# Altium project LXe_digitizer.PrjPcb (part 1 of 3)
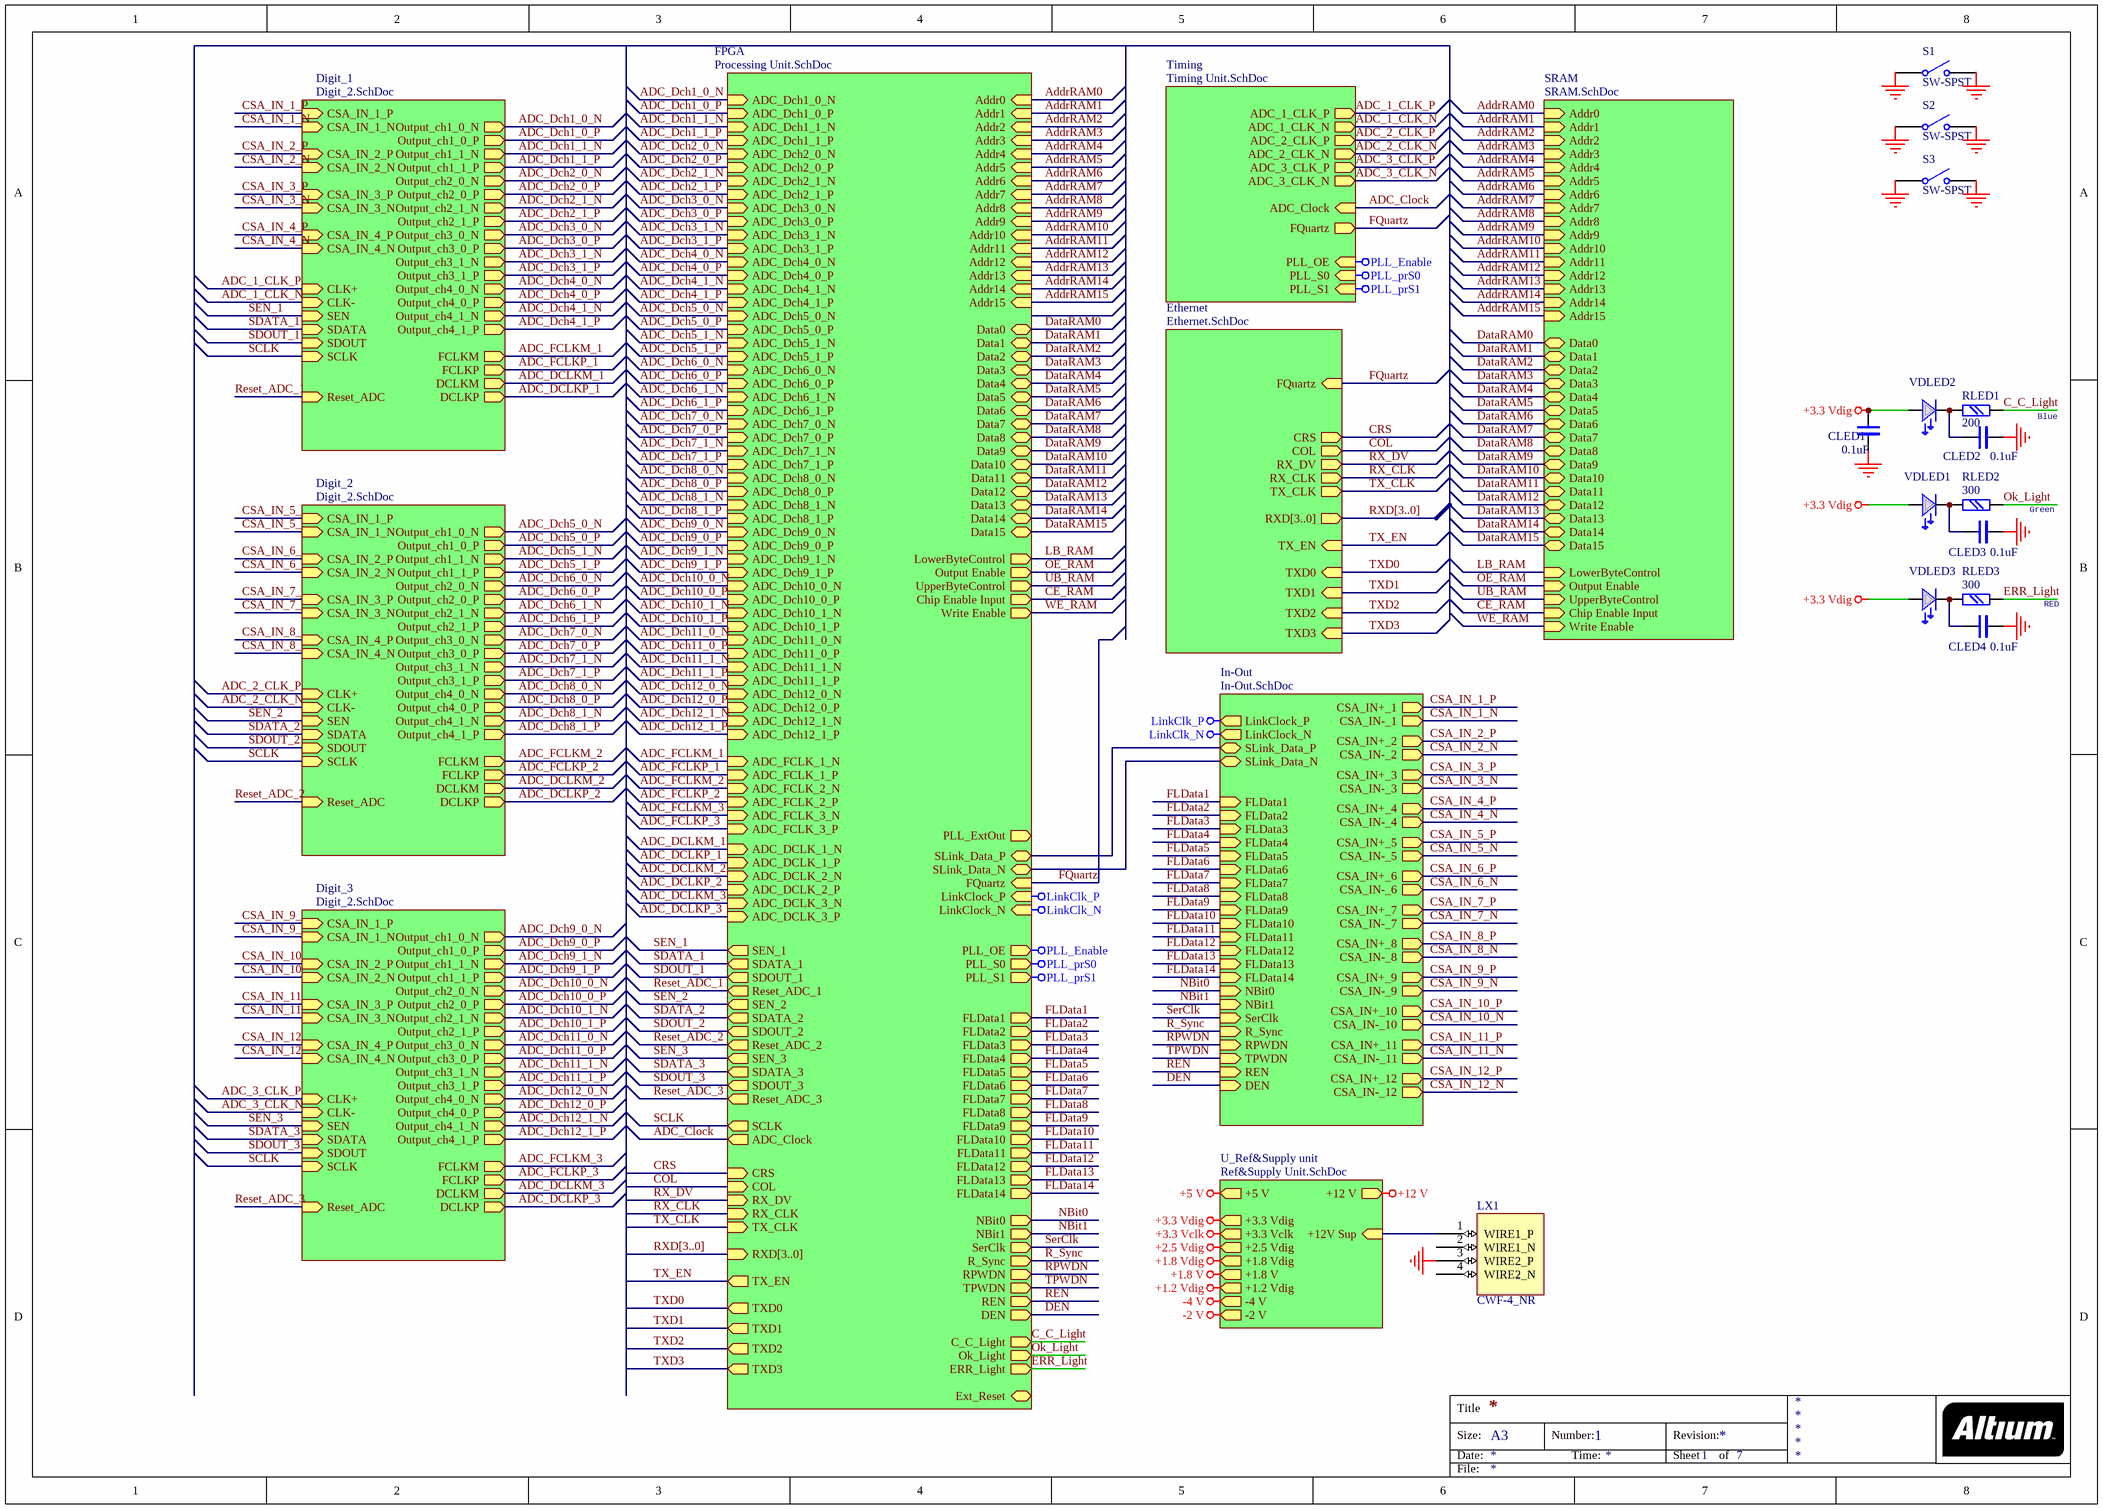
[diagram p0: Main schem.SchDoc]
9 sheets, 784 parts. Net scope: hierarchical (ports join the sheet entries above them; power ports are global).
Board file: New_LXe_twr.PcbDoc
Sheets:
  Main schem.SchDoc
    Digit_1 = Digit_2.SchDoc
      Analog_input = Analog.SchDoc
      Analog_input = Analog.SchDoc
      Analog_input = Analog.SchDoc
      Analog_input = Analog.SchDoc
    U_Ref&Supply unit = Ref&Supply Unit.SchDoc
    FPGA = Processing Unit.SchDoc
    Timing = Timing Unit.SchDoc
    In-Out = In-Out.SchDoc
    Ethernet = Ethernet.SchDoc
    Digit_2 = Digit_2.SchDoc
      Analog_input = Analog.SchDoc
      Analog_input = Analog.SchDoc
      Analog_input = Analog.SchDoc
      Analog_input = Analog.SchDoc
    Digit_3 = Digit_2.SchDoc
      Analog_input = Analog.SchDoc
      Analog_input = Analog.SchDoc
      Analog_input = Analog.SchDoc
      Analog_input = Analog.SchDoc
    SRAM = SRAM.SchDoc

## Sheet Main schem.SchDoc
size A3; DocumentNumber: 1; SheetNumber: 1; SheetTotal: 7

### Parts
CLED1  0.1uF  [chip0805]
CLED2  0.1uF  [chip0603]
CLED3  0.1uF  [chip0603]
CLED4  0.1uF  [chip0603]
LX1  CWF-4_NR  [CWF-4R]
RLED1  200  [chip0603]
RLED2  300  [chip0603]
RLED3  300  [chip0603]
S1  SW-SPST  [SPST-2]
S2  SW-SPST  [SPST-2]
S3  SW-SPST  [SPST-2]
VDLED1  LED  [LED0805]  (value not drawn)
VDLED2  LED  [LED1206]  (value not drawn)
VDLED3  LED  [LED1206]  (value not drawn)

### Sub-sheets
Digit_1 = Digit_2.SchDoc: Output_ch1_0_P (out), Output_ch1_0_N (out), Output_ch1_1_P (out), Output_ch1_1_N (out), CLK+ (in), Output_ch2_0_N (out), Output_ch2_0_P (out), Output_ch2_1_N (out), Output_ch2_1_P (out), Output_ch3_0_N (out), Output_ch3_0_P (out), Output_ch3_1_N (out), Output_ch3_1_P (out), Output_ch4_0_N (out), Output_ch4_0_P (out), Output_ch4_1_N (out), Output_ch4_1_P (out), CLK- (in), CSA_IN_1_P (in), CSA_IN_1_N (in), CSA_IN_2_P (in), CSA_IN_2_N (in), CSA_IN_3_P (in), CSA_IN_3_N (in), CSA_IN_4_P (in), CSA_IN_4_N (in), SEN (in), SDATA (in), SCLK (in), SDOUT (in), Reset_ADC (in), FCLKM (out), FCLKP (out), DCLKM (out), DCLKP (out)
Digit_2 = Digit_2.SchDoc: Output_ch1_0_P (out), Output_ch1_0_N (out), Output_ch1_1_P (out), Output_ch1_1_N (out), CLK+ (in), Output_ch2_0_N (out), Output_ch2_0_P (out), Output_ch2_1_N (out), Output_ch2_1_P (out), Output_ch3_0_N (out), Output_ch3_0_P (out), Output_ch3_1_N (out), Output_ch3_1_P (out), Output_ch4_0_N (out), Output_ch4_0_P (out), Output_ch4_1_N (out), Output_ch4_1_P (out), CLK- (in), CSA_IN_1_P (in), CSA_IN_1_N (in), CSA_IN_2_P (in), CSA_IN_2_N (in), CSA_IN_3_P (in), CSA_IN_3_N (in), CSA_IN_4_P (in), CSA_IN_4_N (in), SEN (in), SDATA (in), SCLK (in), SDOUT (in), Reset_ADC (in), FCLKM (out), FCLKP (out), DCLKM (out), DCLKP (out)
Digit_3 = Digit_2.SchDoc: Output_ch1_0_P (out), Output_ch1_0_N (out), Output_ch1_1_P (out), Output_ch1_1_N (out), CLK+ (in), Output_ch2_0_N (out), Output_ch2_0_P (out), Output_ch2_1_N (out), Output_ch2_1_P (out), Output_ch3_0_N (out), Output_ch3_0_P (out), Output_ch3_1_N (out), Output_ch3_1_P (out), Output_ch4_0_N (out), Output_ch4_0_P (out), Output_ch4_1_N (out), Output_ch4_1_P (out), CLK- (in), CSA_IN_1_P (in), CSA_IN_1_N (in), CSA_IN_2_P (in), CSA_IN_2_N (in), CSA_IN_3_P (in), CSA_IN_3_N (in), CSA_IN_4_P (in), CSA_IN_4_N (in), SEN (in), SDATA (in), SCLK (in), SDOUT (in), Reset_ADC (in), FCLKM (out), FCLKP (out), DCLKM (out), DCLKP (out)
Ethernet = Ethernet.SchDoc: COL (out), TX_EN (in), TX_CLK (out), RX_CLK (out), RX_DV (out), TXD0 (in), RXD[3..0] (out), CRS (out), FQuartz (in), TXD1 (in), TXD2 (in), TXD3 (in)
FPGA = Processing Unit.SchDoc: ADC_Dch1_0_P (in), ADC_Dch1_0_N (in), ERR_Light (out), Ok_Light (out), C_C_Light (out), LinkClock_P (in), SLink_Data_P (bidir), SLink_Data_N (bidir), PLL_ExtOut (out), FQuartz (in), Ext_Reset, PLL_OE (out), PLL_S0 (out), PLL_S1 (out), FLData1 (out), FLData2 (out), FLData3 (out), FLData4 (out), FLData5 (out), FLData6 (out), FLData7 (out), FLData8 (out), NBit0 (out), NBit1 (out), SerClk (out), R_Sync (out), RPWDN (out), FLData9 (out), FLData10 (out), TPWDN (out), REN (out), DEN (out), SEN_1 (out), SDATA_1 (out), SCLK (out), SDOUT_1 (out), ADC_Dch1_1_P (in), ADC_Dch1_1_N (in), ADC_Dch2_0_P (in), ADC_Dch2_0_N (in), ADC_Dch2_1_P (in), ADC_Dch2_1_N (in), ADC_Dch3_0_P (in), ADC_Dch3_0_N (in), ADC_Dch3_1_P (in), ADC_Dch3_1_N (in), ADC_Dch4_0_P (in), ADC_Dch4_0_N (in), ADC_Dch4_1_P (in), ADC_Dch4_1_N (in), ADC_Dch5_0_P (in), ADC_Dch5_0_N (in), ADC_Dch5_1_P (in), ADC_Dch5_1_N (in), ADC_Dch6_0_P (in), ADC_Dch6_0_N (in), ADC_Dch6_1_P (in), ADC_Dch6_1_N (in), ADC_Dch7_0_P (in), ADC_Dch7_0_N (in), ADC_Dch7_1_P (in), ADC_Dch7_1_N (in), ADC_Dch8_0_P (in), ADC_Dch8_0_N (in), ADC_Dch8_1_P (in), ADC_Dch8_1_N (in), ADC_Dch9_0_P (in), ADC_Dch9_0_N (in), ADC_Dch9_1_P (in), ADC_Dch9_1_N (in), ADC_Dch10_0_P (in), ADC_Dch10_0_N (in), ADC_Dch10_1_P (in), ADC_Dch10_1_N (in), ADC_Dch11_0_P (in), ADC_Dch11_0_N (in), ADC_Dch11_1_P (in), ADC_Dch11_1_N (in), ADC_Dch12_0_P (in), ADC_Dch12_0_N (in), ADC_Dch12_1_P (in), ADC_Dch12_1_N (in), FLData11 (out), FLData12 (out), FLData13 (out), FLData14 (out), COL (in), TX_EN (out), TX_CLK (in), RX_CLK (in), RX_DV (in), RXD[3..0] (in), CRS (in), ADC_FCLK_1_P (in), ADC_FCLK_1_N (in), ADC_FCLK_2_P (in), ADC_FCLK_2_N (in), ADC_FCLK_3_P (in), ADC_FCLK_3_N (in), TXD0 (out), TXD1 (out), TXD2 (out), TXD3 (out), LinkClock_N (in), Addr0 (in), Addr1 (in), Addr2 (in), Addr3 (in), Addr4 (in), Addr5 (in), Addr6 (in), Addr7 (in), Addr8 (in), Addr9 (in), Addr10 (in), Addr11 (in), Addr12 (in), Addr13 (in), Addr14 (in), Addr15 (in), Data0 (bidir), Data1 (bidir), Data2 (bidir), Data3 (bidir), Data4 (bidir), Data5 (bidir), Data6 (bidir), Data7 (bidir), Data8 (bidir), Data9 (bidir), Data10 (bidir), Data11 (bidir), Data12 (bidir), Data13 (bidir), Data14 (bidir), Data15 (bidir), LowerByteControl (out), Output Enable (out), UpperByteControl (out), Chip Enable Input (out), Write Enable (out), SEN_2 (out), SDATA_2 (out), SDOUT_2 (out), SEN_3 (out), SDATA_3 (out), SDOUT_3 (out), ADC_DCLK_1_P (in), ADC_DCLK_1_N (in), ADC_DCLK_2_P (in), ADC_DCLK_2_N (in), ADC_DCLK_3_P (in), ADC_DCLK_3_N (in), ADC_Clock (out), Reset_ADC_1 (out), Reset_ADC_2 (out), Reset_ADC_3 (out)
In-Out = In-Out.SchDoc: SLink_Data_N (bidir), SLink_Data_P (bidir), LinkClock_P (out), FLData1 (in), FLData2 (in), FLData3 (in), FLData4 (in), FLData5 (in), FLData6 (in), FLData7 (in), FLData8 (in), NBit0 (in), NBit1 (in), SerClk (in), R_Sync (in), RPWDN (in), CSA_IN+_1 (out), CSA_IN-_1 (out), CSA_IN+_2 (out), CSA_IN-_2 (out), CSA_IN+_3 (out), CSA_IN-_3 (out), CSA_IN+_4 (out), CSA_IN-_4 (out), CSA_IN+_5 (out), CSA_IN-_5 (out), CSA_IN+_6 (out), CSA_IN-_6 (out), FLData9 (in), FLData10 (in), TPWDN (in), REN (in), DEN (in), CSA_IN+_7 (out), CSA_IN-_7 (out), CSA_IN+_8 (out), CSA_IN-_8 (out), CSA_IN+_9 (out), CSA_IN-_9 (out), CSA_IN+_10 (out), CSA_IN-_10 (out), CSA_IN+_11 (out), CSA_IN-_11 (out), CSA_IN+_12 (out), CSA_IN-_12 (out), FLData11 (in), FLData12 (in), FLData13 (in), FLData14 (in), LinkClock_N (out)
SRAM = SRAM.SchDoc: Addr0 (in), Addr1 (in), Addr2 (in), Addr3 (in), Addr4 (in), Addr5 (in), Addr6 (in), Addr7 (in), Addr8 (in), Addr9 (in), Addr10 (in), Addr11 (in), Addr12 (in), Addr13 (in), Addr14 (in), Addr15 (in), Data0 (bidir), Data1 (bidir), Data2 (bidir), Data3 (bidir), Data4 (bidir), Data5 (bidir), Data6 (bidir), Data7 (bidir), Data8 (bidir), Data9 (bidir), Data10 (bidir), Data11 (bidir), Data12 (bidir), Data13 (bidir), Data14 (bidir), Data15 (bidir), LowerByteControl (in), Output Enable (in), UpperByteControl (in), Chip Enable Input (in), Write Enable (in)
Timing = Timing Unit.SchDoc: FQuartz (out), PLL_OE (in), PLL_S0 (in), PLL_S1 (in), ADC_1_CLK_P (out), ADC_1_CLK_N (out), ADC_2_CLK_N (out), ADC_2_CLK_P (out), ADC_3_CLK_P (out), ADC_3_CLK_N (out), ADC_Clock (in)
U_Ref&Supply unit = Ref&Supply Unit.SchDoc: +12V Sup (in), +5 V (out), +3.3 Vdig (out), +3.3 Vclk (out), +2.5 Vdig (out), +1.8 Vdig (out), +1.8 V (out), +1.2 Vdig (out), -4 V (out), -2 V (out), +12 V (out)

### Nets
+3.3 Vdig: CLED1.1 VDLED1.ANOD VDLED2.ANOD VDLED3.ANOD ; sheet U_Ref&Supply unit/+3.3 Vdig
+12 V: LX1.1(WIRE1_P) ; sheet U_Ref&Supply unit/+12V Sup, sheet U_Ref&Supply unit/+12 V
GND: CLED1.2 CLED2.2 CLED3.2 CLED4.2 LX1.3(WIRE2_P) S1.1(COMMON) S1.2(NO) S2.1(COMMON) S2.2(NO) S3.1(COMMON) S3.2(NO)
LinkClk_N: sheet FPGA/LinkClock_N, sheet In-Out/LinkClock_N
LinkClk_P: sheet FPGA/LinkClock_P, sheet In-Out/LinkClock_P
PLL_Enable: sheet FPGA/PLL_OE, sheet Timing/PLL_OE  [project net PLL_OE]
PLL_prS0: sheet FPGA/PLL_S0, sheet Timing/PLL_S0  [project net PLL_S0]
PLL_prS1: sheet FPGA/PLL_S1, sheet Timing/PLL_S1  [project net PLL_S1]
ADC_1_CLK_N: sheet Digit_1/CLK-, sheet Timing/ADC_1_CLK_N
ADC_1_CLK_P: sheet Digit_1/CLK+, sheet Timing/ADC_1_CLK_P
ADC_2_CLK_N: sheet Timing/ADC_2_CLK_N, sheet Digit_2/CLK-
ADC_2_CLK_P: sheet Timing/ADC_2_CLK_P, sheet Digit_2/CLK+
ADC_3_CLK_N: sheet Timing/ADC_3_CLK_N, sheet Digit_3/CLK-
ADC_3_CLK_P: sheet Timing/ADC_3_CLK_P, sheet Digit_3/CLK+
ADC_Clock: sheet FPGA/ADC_Clock, sheet Timing/ADC_Clock
ADC_Dch1_0_N: sheet Digit_1/Output_ch1_0_N, sheet FPGA/ADC_Dch1_0_N
ADC_Dch1_0_P: sheet Digit_1/Output_ch1_0_P, sheet FPGA/ADC_Dch1_0_P
ADC_Dch1_1_N: sheet Digit_1/Output_ch1_1_N, sheet FPGA/ADC_Dch1_1_N
ADC_Dch1_1_P: sheet Digit_1/Output_ch1_1_P, sheet FPGA/ADC_Dch1_1_P
ADC_Dch2_0_N: sheet Digit_1/Output_ch2_0_N, sheet FPGA/ADC_Dch2_0_N
ADC_Dch2_0_P: sheet Digit_1/Output_ch2_0_P, sheet FPGA/ADC_Dch2_0_P
ADC_Dch2_1_N: sheet Digit_1/Output_ch2_1_N, sheet FPGA/ADC_Dch2_1_N
ADC_Dch2_1_P: sheet Digit_1/Output_ch2_1_P, sheet FPGA/ADC_Dch2_1_P
ADC_Dch3_0_N: sheet Digit_1/Output_ch3_0_N, sheet FPGA/ADC_Dch3_0_N
ADC_Dch3_0_P: sheet Digit_1/Output_ch3_0_P, sheet FPGA/ADC_Dch3_0_P
ADC_Dch3_1_N: sheet Digit_1/Output_ch3_1_N, sheet FPGA/ADC_Dch3_1_N
ADC_Dch3_1_P: sheet Digit_1/Output_ch3_1_P, sheet FPGA/ADC_Dch3_1_P
ADC_Dch4_0_N: sheet Digit_1/Output_ch4_0_N, sheet FPGA/ADC_Dch4_0_N
ADC_Dch4_0_P: sheet Digit_1/Output_ch4_0_P, sheet FPGA/ADC_Dch4_0_P
ADC_Dch4_1_N: sheet Digit_1/Output_ch4_1_N, sheet FPGA/ADC_Dch4_1_N
ADC_Dch4_1_P: sheet Digit_1/Output_ch4_1_P, sheet FPGA/ADC_Dch4_1_P
ADC_Dch5_0_N: sheet FPGA/ADC_Dch5_0_N, sheet Digit_2/Output_ch1_0_N
ADC_Dch5_0_P: sheet FPGA/ADC_Dch5_0_P, sheet Digit_2/Output_ch1_0_P
ADC_Dch5_1_N: sheet FPGA/ADC_Dch5_1_N, sheet Digit_2/Output_ch1_1_N
ADC_Dch5_1_P: sheet FPGA/ADC_Dch5_1_P, sheet Digit_2/Output_ch1_1_P
ADC_Dch6_0_N: sheet FPGA/ADC_Dch6_0_N, sheet Digit_2/Output_ch2_0_N
ADC_Dch6_0_P: sheet FPGA/ADC_Dch6_0_P, sheet Digit_2/Output_ch2_0_P
ADC_Dch6_1_N: sheet FPGA/ADC_Dch6_1_N, sheet Digit_2/Output_ch2_1_N
ADC_Dch6_1_P: sheet FPGA/ADC_Dch6_1_P, sheet Digit_2/Output_ch2_1_P
ADC_Dch7_0_N: sheet FPGA/ADC_Dch7_0_N, sheet Digit_2/Output_ch3_0_N
ADC_Dch7_0_P: sheet FPGA/ADC_Dch7_0_P, sheet Digit_2/Output_ch3_0_P
ADC_Dch7_1_N: sheet FPGA/ADC_Dch7_1_N, sheet Digit_2/Output_ch3_1_N
ADC_Dch7_1_P: sheet FPGA/ADC_Dch7_1_P, sheet Digit_2/Output_ch3_1_P
ADC_Dch8_0_N: sheet FPGA/ADC_Dch8_0_N, sheet Digit_2/Output_ch4_0_N
ADC_Dch8_0_P: sheet FPGA/ADC_Dch8_0_P, sheet Digit_2/Output_ch4_0_P
ADC_Dch8_1_N: sheet FPGA/ADC_Dch8_1_N, sheet Digit_2/Output_ch4_1_N
ADC_Dch8_1_P: sheet FPGA/ADC_Dch8_1_P, sheet Digit_2/Output_ch4_1_P
ADC_Dch9_0_N: sheet FPGA/ADC_Dch9_0_N, sheet Digit_3/Output_ch1_0_N
ADC_Dch9_0_P: sheet FPGA/ADC_Dch9_0_P, sheet Digit_3/Output_ch1_0_P
ADC_Dch9_1_N: sheet FPGA/ADC_Dch9_1_N, sheet Digit_3/Output_ch1_1_N
ADC_Dch9_1_P: sheet FPGA/ADC_Dch9_1_P, sheet Digit_3/Output_ch1_1_P
ADC_Dch10_0_N: sheet FPGA/ADC_Dch10_0_N, sheet Digit_3/Output_ch2_0_N
ADC_Dch10_0_P: sheet FPGA/ADC_Dch10_0_P, sheet Digit_3/Output_ch2_0_P
ADC_Dch10_1_N: sheet FPGA/ADC_Dch10_1_N, sheet Digit_3/Output_ch2_1_N
ADC_Dch10_1_P: sheet FPGA/ADC_Dch10_1_P, sheet Digit_3/Output_ch2_1_P
ADC_Dch11_0_N: sheet FPGA/ADC_Dch11_0_N, sheet Digit_3/Output_ch3_0_N
ADC_Dch11_0_P: sheet FPGA/ADC_Dch11_0_P, sheet Digit_3/Output_ch3_0_P
ADC_Dch11_1_N: sheet FPGA/ADC_Dch11_1_N, sheet Digit_3/Output_ch3_1_N
ADC_Dch11_1_P: sheet FPGA/ADC_Dch11_1_P, sheet Digit_3/Output_ch3_1_P
ADC_Dch12_0_N: sheet FPGA/ADC_Dch12_0_N, sheet Digit_3/Output_ch4_0_N
ADC_Dch12_0_P: sheet FPGA/ADC_Dch12_0_P, sheet Digit_3/Output_ch4_0_P
ADC_Dch12_1_N: sheet FPGA/ADC_Dch12_1_N, sheet Digit_3/Output_ch4_1_N
ADC_Dch12_1_P: sheet FPGA/ADC_Dch12_1_P, sheet Digit_3/Output_ch4_1_P
ADC_DCLKM_1: sheet Digit_1/DCLKM, sheet FPGA/ADC_DCLK_1_N  [project net ADC_DCLK_1_N]
ADC_DCLKM_2: sheet FPGA/ADC_DCLK_2_N, sheet Digit_2/DCLKM  [project net ADC_DCLK_2_N]
ADC_DCLKM_3: sheet FPGA/ADC_DCLK_3_N, sheet Digit_3/DCLKM  [project net ADC_DCLK_3_N]
ADC_DCLKP_1: sheet Digit_1/DCLKP, sheet FPGA/ADC_DCLK_1_P  [project net ADC_DCLK_1_P]
ADC_DCLKP_2: sheet FPGA/ADC_DCLK_2_P, sheet Digit_2/DCLKP  [project net ADC_DCLK_2_P]
ADC_DCLKP_3: sheet FPGA/ADC_DCLK_3_P, sheet Digit_3/DCLKP  [project net ADC_DCLK_3_P]
ADC_FCLKM_1: sheet Digit_1/FCLKM, sheet FPGA/ADC_FCLK_1_N  [project net ADC_FCLK_1_N]
ADC_FCLKM_2: sheet FPGA/ADC_FCLK_2_N, sheet Digit_2/FCLKM  [project net ADC_FCLK_2_N]
ADC_FCLKM_3: sheet FPGA/ADC_FCLK_3_N, sheet Digit_3/FCLKM  [project net ADC_FCLK_3_N]
ADC_FCLKP_1: sheet Digit_1/FCLKP, sheet FPGA/ADC_FCLK_1_P  [project net ADC_FCLK_1_P]
ADC_FCLKP_2: sheet FPGA/ADC_FCLK_2_P, sheet Digit_2/FCLKP  [project net ADC_FCLK_2_P]
ADC_FCLKP_3: sheet FPGA/ADC_FCLK_3_P, sheet Digit_3/FCLKP  [project net ADC_FCLK_3_P]
AddrRAM0: sheet FPGA/Addr0, sheet SRAM/Addr0
AddrRAM1: sheet FPGA/Addr1, sheet SRAM/Addr1
AddrRAM2: sheet FPGA/Addr2, sheet SRAM/Addr2
AddrRAM3: sheet FPGA/Addr3, sheet SRAM/Addr3
AddrRAM4: sheet FPGA/Addr4, sheet SRAM/Addr4
AddrRAM5: sheet FPGA/Addr5, sheet SRAM/Addr5
AddrRAM6: sheet FPGA/Addr6, sheet SRAM/Addr6
AddrRAM7: sheet FPGA/Addr7, sheet SRAM/Addr7
AddrRAM8: sheet FPGA/Addr8, sheet SRAM/Addr8
AddrRAM9: sheet FPGA/Addr9, sheet SRAM/Addr9
AddrRAM10: sheet FPGA/Addr10, sheet SRAM/Addr10
AddrRAM11: sheet FPGA/Addr11, sheet SRAM/Addr11
AddrRAM12: sheet FPGA/Addr12, sheet SRAM/Addr12
AddrRAM13: sheet FPGA/Addr13, sheet SRAM/Addr13
AddrRAM14: sheet FPGA/Addr14, sheet SRAM/Addr14
AddrRAM15: sheet FPGA/Addr15, sheet SRAM/Addr15
C_C_Light: RLED1.2 ; sheet FPGA/C_C_Light  [project net C_C_LED]
CE_RAM: sheet FPGA/Chip Enable Input, sheet SRAM/Chip Enable Input
COL: sheet FPGA/COL, sheet Ethernet/COL
CRS: sheet FPGA/CRS, sheet Ethernet/CRS
CSA_IN_1_N: sheet Digit_1/CSA_IN_1_N, sheet In-Out/CSA_IN-_1  [project net CSA_IN-_1]
CSA_IN_1_P: sheet Digit_1/CSA_IN_1_P, sheet In-Out/CSA_IN+_1  [project net CSA_IN+_1]
CSA_IN_2_N: sheet Digit_1/CSA_IN_2_N, sheet In-Out/CSA_IN-_2  [project net CSA_IN-_2]
CSA_IN_2_P: sheet Digit_1/CSA_IN_2_P, sheet In-Out/CSA_IN+_2  [project net CSA_IN+_2]
CSA_IN_3_N: sheet Digit_1/CSA_IN_3_N, sheet In-Out/CSA_IN-_3  [project net CSA_IN-_3]
CSA_IN_3_P: sheet Digit_1/CSA_IN_3_P, sheet In-Out/CSA_IN+_3  [project net CSA_IN+_3]
CSA_IN_4_N: sheet Digit_1/CSA_IN_4_N, sheet In-Out/CSA_IN-_4  [project net CSA_IN-_4]
CSA_IN_4_P: sheet Digit_1/CSA_IN_4_P, sheet In-Out/CSA_IN+_4  [project net CSA_IN+_4]
CSA_IN_5_N: sheet In-Out/CSA_IN-_5, sheet Digit_2/CSA_IN_1_N  [project net CSA_IN-_5]
CSA_IN_5_P: sheet In-Out/CSA_IN+_5, sheet Digit_2/CSA_IN_1_P  [project net CSA_IN+_5]
CSA_IN_6_N: sheet In-Out/CSA_IN-_6, sheet Digit_2/CSA_IN_2_N  [project net CSA_IN-_6]
CSA_IN_6_P: sheet In-Out/CSA_IN+_6, sheet Digit_2/CSA_IN_2_P  [project net CSA_IN+_6]
CSA_IN_7_N: sheet In-Out/CSA_IN-_7, sheet Digit_2/CSA_IN_3_N  [project net CSA_IN-_7]
CSA_IN_7_P: sheet In-Out/CSA_IN+_7, sheet Digit_2/CSA_IN_3_P  [project net CSA_IN+_7]
CSA_IN_8_N: sheet In-Out/CSA_IN-_8, sheet Digit_2/CSA_IN_4_N  [project net CSA_IN-_8]
CSA_IN_8_P: sheet In-Out/CSA_IN+_8, sheet Digit_2/CSA_IN_4_P  [project net CSA_IN+_8]
CSA_IN_9_N: sheet In-Out/CSA_IN-_9, sheet Digit_3/CSA_IN_1_N  [project net CSA_IN-_9]
CSA_IN_9_P: sheet In-Out/CSA_IN+_9, sheet Digit_3/CSA_IN_1_P  [project net CSA_IN+_9]
CSA_IN_10_N: sheet In-Out/CSA_IN-_10, sheet Digit_3/CSA_IN_2_N  [project net CSA_IN-_10]
CSA_IN_10_P: sheet In-Out/CSA_IN+_10, sheet Digit_3/CSA_IN_2_P  [project net CSA_IN+_10]
CSA_IN_11_N: sheet In-Out/CSA_IN-_11, sheet Digit_3/CSA_IN_3_N  [project net CSA_IN-_11]
CSA_IN_11_P: sheet In-Out/CSA_IN+_11, sheet Digit_3/CSA_IN_3_P  [project net CSA_IN+_11]
CSA_IN_12_N: sheet In-Out/CSA_IN-_12, sheet Digit_3/CSA_IN_4_N  [project net CSA_IN-_12]
CSA_IN_12_P: sheet In-Out/CSA_IN+_12, sheet Digit_3/CSA_IN_4_P  [project net CSA_IN+_12]
DataRAM0: sheet FPGA/Data0, sheet SRAM/Data0
DataRAM1: sheet FPGA/Data1, sheet SRAM/Data1
DataRAM2: sheet FPGA/Data2, sheet SRAM/Data2
DataRAM3: sheet FPGA/Data3, sheet SRAM/Data3
DataRAM4: sheet FPGA/Data4, sheet SRAM/Data4
DataRAM5: sheet FPGA/Data5, sheet SRAM/Data5
DataRAM6: sheet FPGA/Data6, sheet SRAM/Data6
DataRAM7: sheet FPGA/Data7, sheet SRAM/Data7
DataRAM8: sheet FPGA/Data8, sheet SRAM/Data8
DataRAM9: sheet FPGA/Data9, sheet SRAM/Data9
DataRAM10: sheet FPGA/Data10, sheet SRAM/Data10
DataRAM11: sheet FPGA/Data11, sheet SRAM/Data11
DataRAM12: sheet FPGA/Data12, sheet SRAM/Data12
DataRAM13: sheet FPGA/Data13, sheet SRAM/Data13
DataRAM14: sheet FPGA/Data14, sheet SRAM/Data14
DataRAM15: sheet FPGA/Data15, sheet SRAM/Data15
DEN: sheet FPGA/DEN, sheet In-Out/DEN
ERR_Light: RLED3.2 ; sheet FPGA/ERR_Light  [project net ERR_LED]
FLData1: sheet FPGA/FLData1, sheet In-Out/FLData1
FLData2: sheet FPGA/FLData2, sheet In-Out/FLData2
FLData3: sheet FPGA/FLData3, sheet In-Out/FLData3
FLData4: sheet FPGA/FLData4, sheet In-Out/FLData4
FLData5: sheet FPGA/FLData5, sheet In-Out/FLData5
FLData6: sheet FPGA/FLData6, sheet In-Out/FLData6
FLData7: sheet FPGA/FLData7, sheet In-Out/FLData7
FLData8: sheet FPGA/FLData8, sheet In-Out/FLData8
FLData9: sheet FPGA/FLData9, sheet In-Out/FLData9
FLData10: sheet FPGA/FLData10, sheet In-Out/FLData10
FLData11: sheet FPGA/FLData11, sheet In-Out/FLData11
FLData12: sheet FPGA/FLData12, sheet In-Out/FLData12
FLData13: sheet FPGA/FLData13, sheet In-Out/FLData13
FLData14: sheet FPGA/FLData14, sheet In-Out/FLData14
FQuartz: sheet FPGA/FQuartz, sheet Timing/FQuartz, sheet Ethernet/FQuartz
LB_RAM: sheet FPGA/LowerByteControl, sheet SRAM/LowerByteControl
NBit0: sheet FPGA/NBit0, sheet In-Out/NBit0
NBit1: sheet FPGA/NBit1, sheet In-Out/NBit1
OE_RAM: sheet FPGA/Output Enable, sheet SRAM/Output Enable
Ok_Light: RLED2.2 ; sheet FPGA/Ok_Light  [project net Ok_LED]
R_Sync: sheet FPGA/R_Sync, sheet In-Out/R_Sync
REN: sheet FPGA/REN, sheet In-Out/REN
Reset_ADC_1: sheet Digit_1/Reset_ADC, sheet FPGA/Reset_ADC_1  [project net Reset_ADC]
Reset_ADC_2: sheet FPGA/Reset_ADC_2, sheet Digit_2/Reset_ADC  [project net Reset_ADC]
Reset_ADC_3: sheet FPGA/Reset_ADC_3, sheet Digit_3/Reset_ADC  [project net Reset_ADC]
RPWDN: sheet FPGA/RPWDN, sheet In-Out/RPWDN
RX_CLK: sheet FPGA/RX_CLK, sheet Ethernet/RX_CLK  [project net EthRX_CLK]
RX_DV: sheet FPGA/RX_DV, sheet Ethernet/RX_DV  [project net EthRX_D V]
SCLK: sheet Digit_1/SCLK, sheet FPGA/SCLK, sheet Digit_2/SCLK, sheet Digit_3/SCLK
SDATA_1: sheet Digit_1/SDATA, sheet FPGA/SDATA_1  [project net SDATA]
SDATA_2: sheet FPGA/SDATA_2, sheet Digit_2/SDATA  [project net SDATA]
SDATA_3: sheet FPGA/SDATA_3, sheet Digit_3/SDATA  [project net SDATA]
SDOUT_1: sheet Digit_1/SDOUT, sheet FPGA/SDOUT_1  [project net SDOUT]
SDOUT_2: sheet FPGA/SDOUT_2, sheet Digit_2/SDOUT  [project net SDOUT]
SDOUT_3: sheet FPGA/SDOUT_3, sheet Digit_3/SDOUT  [project net SDOUT]
SEN_1: sheet Digit_1/SEN, sheet FPGA/SEN_1  [project net SEN]
SEN_2: sheet FPGA/SEN_2, sheet Digit_2/SEN  [project net SEN]
SEN_3: sheet FPGA/SEN_3, sheet Digit_3/SEN  [project net SEN]
SerClk: sheet FPGA/SerClk, sheet In-Out/SerClk
SLink_Data_N: sheet FPGA/SLink_Data_N, sheet In-Out/SLink_Data_N
SLink_Data_P: sheet FPGA/SLink_Data_P, sheet In-Out/SLink_Data_P
TPWDN: sheet FPGA/TPWDN, sheet In-Out/TPWDN
TX_CLK: sheet FPGA/TX_CLK, sheet Ethernet/TX_CLK  [project net EthTX_CLK]
TX_EN: sheet FPGA/TX_EN, sheet Ethernet/TX_EN  [project net EthTX_EN]
TXD0: sheet FPGA/TXD0, sheet Ethernet/TXD0  [project net EthTXD0]
TXD1: sheet FPGA/TXD1, sheet Ethernet/TXD1  [project net EthTXD1]
TXD2: sheet FPGA/TXD2, sheet Ethernet/TXD2  [project net EthTXD2]
TXD3: sheet FPGA/TXD3, sheet Ethernet/TXD3  [project net EthTXD3]
UB_RAM: sheet FPGA/UpperByteControl, sheet SRAM/UpperByteControl
WE_RAM: sheet FPGA/Write Enable, sheet SRAM/Write Enable
NetCLED2_1: CLED2.1 RLED1.1 VDLED2.CATH
NetCLED3_1: CLED3.1 RLED2.1 VDLED1.CATH
NetCLED4_1: CLED4.1 RLED3.1 VDLED3.CATH

Not connected (* = marked no-connect by the designer): LX1 2(WIRE1_N) 4(WIRE2_N)

### Buses and harness runs
bus RXD[3..0] = sheet Ethernet/RXD[3..0]
bus RXD[3..0] = sheet FPGA/RXD[3..0]

### Notes on the sheet
- Blue
- Green
- RED
- Title
- Size:
- Date:
- A3
- Number:
- Time:
- Revision:
- Sheet
- of
- File:

### Library data of the parts
CLED1-CLED4 = C: Text Field1: 20; Text Field2: 10
LX1 = CWF-4-R
RLED1-RLED3 = R: Text Field1: 20; Text Field2: 20
S1-S3 = SW-SPST: Single-Pole, Single-Throw Switch; Published: 24-Mar-1999; LatestRevisionDate: 17-Jul-2002; LatestRevisionNote: Re-released for DXP Platform.; PackageReference: SPST-2; Publisher: Altium Limited; PackageDescription: Switch; 2 Leads
VDLED1-VDLED3 = AL307: Text Field1: 10; Text Field2: 30

## Sheet Digit_2.SchDoc
size A3; DocumentNumber: 2; SheetNumber: 2; SheetTotal: 7
Used 3 times, as channels Digit_1, Digit_2, Digit_3. Parts and nets are listed once, with the designators drawn on the sheet.
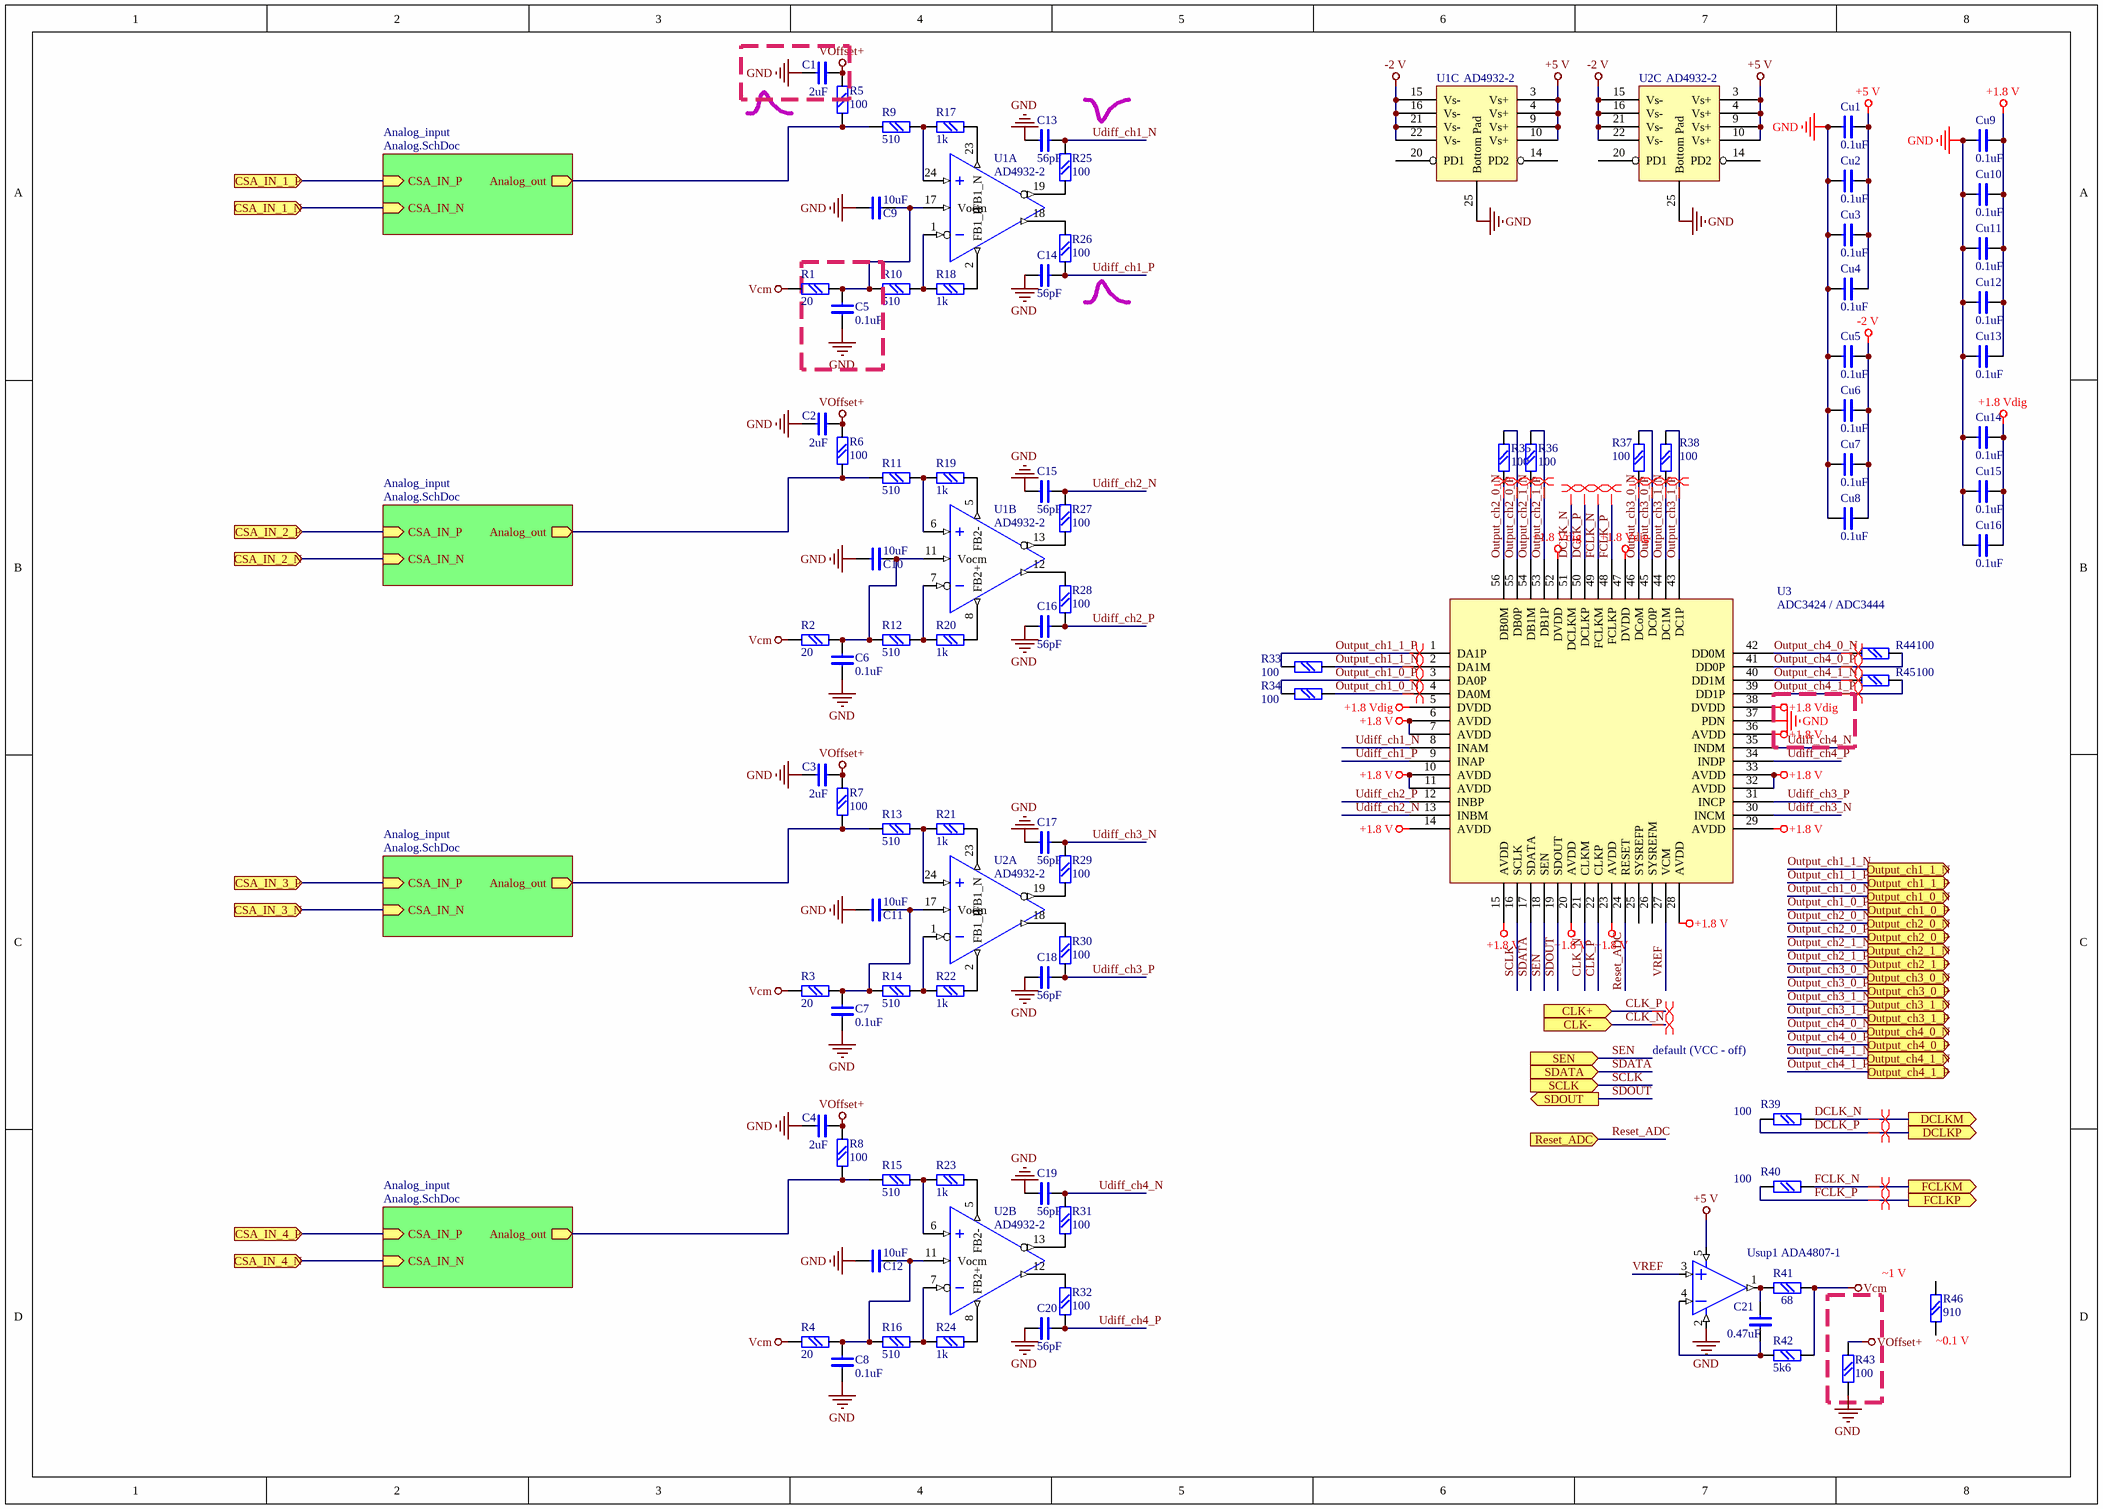
[diagram p1: Digit_2.SchDoc]

### Parts
C1  2uF  [chip0603]
C2  2uF  [chip0603]
C3  2uF  [chip0603]
C4  2uF  [chip0603]
C5  0.1uF  [chip0603]
C6  0.1uF  [chip0603]
C7  0.1uF  [chip0603]
C8  0.1uF  [chip0603]
C9  10uF  [chip0603]
C10  10uF  [chip0603]
C11  10uF  [chip0603]
C12  10uF  [chip0603]
C13  56pF  [chip0603]
C14  56pF  [chip0603]
C15  56pF  [chip0603]
C16  56pF  [chip0603]
C17  56pF  [chip0603]
C18  56pF  [chip0603]
C19  56pF  [chip0603]
C20  56pF  [chip0603]
C21  0.47uF  [chip0603]
Cu1  0.1uF  [chip0603]
Cu2  0.1uF  [chip0603]
Cu3  0.1uF  [chip0603]
Cu4  0.1uF  [chip0603]
Cu5  0.1uF  [chip0603]
Cu6  0.1uF  [chip0603]
Cu7  0.1uF  [chip0603]
Cu8  0.1uF  [chip0603]
Cu9  0.1uF  [chip0603]
Cu10  0.1uF  [chip0603]
Cu11  0.1uF  [chip0603]
Cu12  0.1uF  [chip0603]
Cu13  0.1uF  [chip0603]
Cu14  0.1uF  [chip0603]
Cu15  0.1uF  [chip0603]
Cu16  0.1uF  [chip0603]
R1  20  [chip0603]
R2  20  [chip0603]
R3  20  [chip0603]
R4  20  [chip0603]
R5  100  [chip0603]
R6  100  [chip0603]
R7  100  [chip0603]
R8  100  [chip0603]
R9  510  [chip0603]
R10  510  [chip0603]
R11  510  [chip0603]
R12  510  [chip0603]
R13  510  [chip0603]
R14  510  [chip0603]
R15  510  [chip0603]
R16  510  [chip0603]
R17  1k  [chip0603]
R18  1k  [chip0603]
R19  1k  [chip0603]
R20  1k  [chip0603]
R21  1k  [chip0603]
R22  1k  [chip0603]
R23  1k  [chip0603]
R24  1k  [chip0603]
R25  100  [chip0603]
R26  100  [chip0603]
R27  100  [chip0603]
R28  100  [chip0603]
R29  100  [chip0603]
R30  100  [chip0603]
R31  100  [chip0603]
R32  100  [chip0603]
R33  100  [0402]
R34  100  [0402]
R35  100  [0402]
R36  100  [0402]
R37  100  [0402]
R38  100  [0402]
R39  100  [0402]
R40  100  [0402]
R41  68  [chip0603]
R42  5k6  [chip0603]
R43  100  [chip0603]
R44  100  [0402]
R45  100  [0402]
R46  910  [chip0603]
U1  AD4932-2  [CP-24-13]  (parts A,B,C of 3)
U2  AD4932-2  [CP-24-13]  (parts A,B,C of 3)
U3  ADC3424 / ADC3444  [PQFN-56]
Usup1  ADA4807-1  [SOT23-5]

### Blocks framed on the sheet
~1 V: R43

### Sub-sheets
Analog_input = Analog.SchDoc: CSA_IN_P (in), CSA_IN_N (in), Analog_out (out)
Analog_input = Analog.SchDoc: CSA_IN_P (in), CSA_IN_N (in), Analog_out (out)
Analog_input = Analog.SchDoc: CSA_IN_P (in), CSA_IN_N (in), Analog_out (out)
Analog_input = Analog.SchDoc: CSA_IN_P (in), CSA_IN_N (in), Analog_out (out)

### Ports
CLK+ (in), CLK- (in), CSA_IN_1_N (in), CSA_IN_1_P (in), CSA_IN_2_N (in), CSA_IN_2_P (in), CSA_IN_3_N (in), CSA_IN_3_P (in), CSA_IN_4_N (in), CSA_IN_4_P (in), DCLKM (out), DCLKP (out), FCLKM (out), FCLKP (out), Output_ch1_0_N (out), Output_ch1_0_P (out), Output_ch1_1_N (out), Output_ch1_1_P (out), Output_ch2_0_N (out), Output_ch2_0_P (out), Output_ch2_1_N (out), Output_ch2_1_P (out), Output_ch3_0_N (out), Output_ch3_0_P (out), Output_ch3_1_N (out), Output_ch3_1_P (out), Output_ch4_0_N (out), Output_ch4_0_P (out), Output_ch4_1_N (out), Output_ch4_1_P (out), Reset_ADC (in), SCLK (in), SDATA (in), SDOUT (out), SEN (in)

### Nets
+1.8 V: Cu9.2 Cu10.2 Cu11.2 Cu12.2 Cu13.2 U3.6(AVDD) U3.7(AVDD) U3.10(AVDD) U3.11(AVDD) U3.14(AVDD) U3.15(AVDD) U3.20(AVDD) U3.23(AVDD) U3.28(AVDD) U3.29(AVDD) U3.32(AVDD) U3.33(AVDD) U3.36(AVDD)
+1.8 Vdig: Cu14.2 Cu15.2 Cu16.2 U3.5(DVDD) U3.38(DVDD) U3.47(DVDD) U3.52(DVDD)
+5 V: Cu1.2 Cu2.2 Cu3.2 Cu4.2 U1.3(Vs+) U1.4(Vs+) U1.9(Vs+) U1.10(Vs+) U2.3(Vs+) U2.4(Vs+) U2.9(Vs+) U2.10(Vs+) Usup1.5(E+)
-2 V: Cu5.2 Cu6.2 Cu7.2 Cu8.2 U1.15(Vs-) U1.16(Vs-) U1.21(Vs-) U1.22(Vs-) U2.15(Vs-) U2.16(Vs-) U2.21(Vs-) U2.22(Vs-)
GND: C1.1 C2.1 C3.1 C4.1 C5.1 C6.1 C7.1 C8.1 C9.1 C10.1 C11.1 C12.1 C13.2 C14.1 C15.2 C16.1 C17.2 C18.1 C19.2 C20.1 Cu1.1 Cu2.1 Cu3.1 Cu4.1 Cu5.1 Cu6.1 Cu7.1 Cu8.1 Cu9.1 Cu10.1 Cu11.1 Cu12.1 Cu13.1 Cu14.1 Cu15.1 Cu16.1 R43.2 U1.25(Bottom_Pad) U2.25(Bottom_Pad) U3.37(PDN) Usup1.2(E-)
Vcm: R1.2 R2.2 R3.2 R4.2 R41.2 R42.2
VOffset+: C1.2 C2.2 C3.2 C4.2 R5.2 R6.2 R7.2 R8.2 R43.1
CLK_N: U3.21(CLKM) ; port CLK-
CLK_P: U3.22(CLKP) ; port CLK+
CSA_IN_1_N: port CSA_IN_1_N, sheet Analog_input/CSA_IN_N
CSA_IN_1_P: port CSA_IN_1_P, sheet Analog_input/CSA_IN_P
CSA_IN_2_N: port CSA_IN_2_N, sheet Analog_input/CSA_IN_N
CSA_IN_2_P: port CSA_IN_2_P, sheet Analog_input/CSA_IN_P
CSA_IN_3_N: port CSA_IN_3_N, sheet Analog_input/CSA_IN_N
CSA_IN_3_P: port CSA_IN_3_P, sheet Analog_input/CSA_IN_P
CSA_IN_4_N: port CSA_IN_4_N, sheet Analog_input/CSA_IN_N
CSA_IN_4_P: port CSA_IN_4_P, sheet Analog_input/CSA_IN_P
DCLK_N: R39.2 U3.51(DCLKM) ; port DCLKM
DCLK_P: R39.1 U3.50(DCLKP) ; port DCLKP
FCLK_N: R40.2 U3.49(FCLKM) ; port FCLKM
FCLK_P: R40.1 U3.48(FCLKP) ; port FCLKP
Output_ch1_0_N: R34.2 U3.4(DA0M) ; port Output_ch1_0_N
Output_ch1_0_P: R34.1 U3.3(DA0P) ; port Output_ch1_0_P
Output_ch1_1_N: R33.2 U3.2(DA1M) ; port Output_ch1_1_N
Output_ch1_1_P: R33.1 U3.1(DA1P) ; port Output_ch1_1_P
Output_ch2_0_N: R35.1 U3.56(DB0M) ; port Output_ch2_0_N
Output_ch2_0_P: R35.2 U3.55(DB0P) ; port Output_ch2_0_P
Output_ch2_1_N: R36.1 U3.54(DB1M) ; port Output_ch2_1_N
Output_ch2_1_P: R36.2 U3.53(DB1P) ; port Output_ch2_1_P
Output_ch3_0_N: R37.1 U3.46(DCoM) ; port Output_ch3_0_N
Output_ch3_0_P: R37.2 U3.45(DC0P) ; port Output_ch3_0_P
Output_ch3_1_N: R38.1 U3.44(DC1M) ; port Output_ch3_1_N
Output_ch3_1_P: R38.2 U3.43(DC1P) ; port Output_ch3_1_P
Output_ch4_0_N: R44.1 U3.42(DD0M) ; port Output_ch4_0_N
Output_ch4_0_P: R44.2 U3.41(DD0P) ; port Output_ch4_0_P
Output_ch4_1_N: R45.1 U3.40(DD1M) ; port Output_ch4_1_N
Output_ch4_1_P: R45.2 U3.39(DD1P) ; port Output_ch4_1_P
Reset_ADC: U3.24(RESET) ; port Reset_ADC
SCLK: U3.16(SCLK) ; port SCLK
SDATA: U3.17(SDATA) ; port SDATA
SDOUT: U3.19(SDOUT) ; port SDOUT
SEN: U3.18(SEN) ; port SEN
Udiff_ch1_N: C13.1 R25.2 U3.8(INAM)
Udiff_ch1_P: C14.2 R26.2 U3.9(INAP)
Udiff_ch2_N: C15.1 R27.2 U3.13(INBM)
Udiff_ch2_P: C16.2 R28.2 U3.12(INBP)
Udiff_ch3_N: C17.1 R29.2 U3.30(INCM)
Udiff_ch3_P: C18.2 R30.2 U3.31(INCP)
Udiff_ch4_N: C19.1 R31.2 U3.35(INDM)
Udiff_ch4_P: C20.2 R32.2 U3.34(INDP)
VREF: U3.27(VCM) Usup1.3(+IN)
NetC5_2: C5.2 C9.2 R1.1 R10.2 U1.17(Vocm)
NetC6_2: C6.2 C10.2 R2.1 R12.2 U1.11(Vocm)
NetC7_2: C7.2 C11.2 R3.1 R14.2 U2.17(Vocm)
NetC8_2: C8.2 C12.2 R4.1 R16.2 U2.11(Vocm)
NetC21_1: C21.1 R41.1 Usup1.1(OUT)
NetC21_2: C21.2 R42.1 Usup1.4(-IN)
NetR5_1: R5.1 R9.2 ; sheet Analog_input/Analog_out
NetR6_1: R6.1 R11.2 ; sheet Analog_input/Analog_out
NetR7_1: R7.1 R13.2 ; sheet Analog_input/Analog_out
NetR8_1: R8.1 R15.2 ; sheet Analog_input/Analog_out
NetR9_1: R9.1 R17.1 U1.24(In+)
NetR10_1: R10.1 R18.2 U1.1(In-)
NetR11_1: R11.1 R19.1 U1.6(In+)
NetR12_1: R12.1 R20.2 U1.7(In-)
NetR13_1: R13.1 R21.1 U2.24(In+)
NetR14_1: R14.1 R22.2 U2.1(In-)
NetR15_1: R15.1 R23.1 U2.6(In+)
NetR16_1: R16.1 R24.2 U2.7(In-)
NetR17_2: R17.2 U1.23(FB1_N)
NetR18_1: R18.1 U1.2(FB1_P)
NetR19_2: R19.2 U1.5(FB2-)
NetR20_1: R20.1 U1.8(FB2+)
NetR21_2: R21.2 U2.23(FB1_N)
NetR22_1: R22.1 U2.2(FB1_P)
NetR23_2: R23.2 U2.5(FB2-)
NetR24_1: R24.1 U2.8(FB2+)
NetR25_1: R25.1 U1.19(Out-)
NetR26_1: R26.1 U1.18(Out+)
NetR27_1: R27.1 U1.13(Out-)
NetR28_1: R28.1 U1.12(Out+)
NetR29_1: R29.1 U2.19(Out-)
NetR30_1: R30.1 U2.18(Out+)
NetR31_1: R31.1 U2.13(Out-)
NetR32_1: R32.1 U2.12(Out+)

Not connected (* = marked no-connect by the designer): R46 1 2; U1 14(PD2) 20(PD1); U2 14(PD2) 20(PD1); U3 25(SYSREFP) 26(SYSREFM)

### Channels
Digit_1: designators end in _Digit_1; ports CLK+=ADC_1_CLK_P CLK-=ADC_1_CLK_N CSA_IN_1_N=CSA_IN-_1 CSA_IN_1_P=CSA_IN+_1 CSA_IN_2_N=CSA_IN-_2 CSA_IN_2_P=CSA_IN+_2 CSA_IN_3_N=CSA_IN-_3 CSA_IN_3_P=CSA_IN+_3 CSA_IN_4_N=CSA_IN-_4 CSA_IN_4_P=CSA_IN+_4 DCLKM=ADC_DCLK_1_N DCLKP=ADC_DCLK_1_P FCLKM=ADC_FCLK_1_N FCLKP=ADC_FCLK_1_P Output_ch1_0_N=ADC_Dch1_0_N Output_ch1_0_P=ADC_Dch1_0_P Output_ch1_1_N=ADC_Dch1_1_N Output_ch1_1_P=ADC_Dch1_1_P Output_ch2_0_N=ADC_Dch2_0_N Output_ch2_0_P=ADC_Dch2_0_P Output_ch2_1_N=ADC_Dch2_1_N Output_ch2_1_P=ADC_Dch2_1_P Output_ch3_0_N=ADC_Dch3_0_N Output_ch3_0_P=ADC_Dch3_0_P Output_ch3_1_N=ADC_Dch3_1_N Output_ch3_1_P=ADC_Dch3_1_P Output_ch4_0_N=ADC_Dch4_0_N Output_ch4_0_P=ADC_Dch4_0_P Output_ch4_1_N=ADC_Dch4_1_N Output_ch4_1_P=ADC_Dch4_1_P Reset_ADC=Reset_ADC SCLK=SCLK SDATA=SDATA SDOUT=SDOUT SEN=SEN
Digit_2: designators end in _Digit_2; ports CLK+=ADC_2_CLK_P CLK-=ADC_2_CLK_N CSA_IN_1_N=CSA_IN-_5 CSA_IN_1_P=CSA_IN+_5 CSA_IN_2_N=CSA_IN-_6 CSA_IN_2_P=CSA_IN+_6 CSA_IN_3_N=CSA_IN-_7 CSA_IN_3_P=CSA_IN+_7 CSA_IN_4_N=CSA_IN-_8 CSA_IN_4_P=CSA_IN+_8 DCLKM=ADC_DCLK_2_N DCLKP=ADC_DCLK_2_P FCLKM=ADC_FCLK_2_N FCLKP=ADC_FCLK_2_P Output_ch1_0_N=ADC_Dch5_0_N Output_ch1_0_P=ADC_Dch5_0_P Output_ch1_1_N=ADC_Dch5_1_N Output_ch1_1_P=ADC_Dch5_1_P Output_ch2_0_N=ADC_Dch6_0_N Output_ch2_0_P=ADC_Dch6_0_P Output_ch2_1_N=ADC_Dch6_1_N Output_ch2_1_P=ADC_Dch6_1_P Output_ch3_0_N=ADC_Dch7_0_N Output_ch3_0_P=ADC_Dch7_0_P Output_ch3_1_N=ADC_Dch7_1_N Output_ch3_1_P=ADC_Dch7_1_P Output_ch4_0_N=ADC_Dch8_0_N Output_ch4_0_P=ADC_Dch8_0_P Output_ch4_1_N=ADC_Dch8_1_N Output_ch4_1_P=ADC_Dch8_1_P Reset_ADC=Reset_ADC SCLK=SCLK SDATA=SDATA SDOUT=SDOUT SEN=SEN
Digit_3: designators end in _Digit_3; ports CLK+=ADC_3_CLK_P CLK-=ADC_3_CLK_N CSA_IN_1_N=CSA_IN-_9 CSA_IN_1_P=CSA_IN+_9 CSA_IN_2_N=CSA_IN-_10 CSA_IN_2_P=CSA_IN+_10 CSA_IN_3_N=CSA_IN-_11 CSA_IN_3_P=CSA_IN+_11 CSA_IN_4_N=CSA_IN-_12 CSA_IN_4_P=CSA_IN+_12 DCLKM=ADC_DCLK_3_N DCLKP=ADC_DCLK_3_P FCLKM=ADC_FCLK_3_N FCLKP=ADC_FCLK_3_P Output_ch1_0_N=ADC_Dch9_0_N Output_ch1_0_P=ADC_Dch9_0_P Output_ch1_1_N=ADC_Dch9_1_N Output_ch1_1_P=ADC_Dch9_1_P Output_ch2_0_N=ADC_Dch10_0_N Output_ch2_0_P=ADC_Dch10_0_P Output_ch2_1_N=ADC_Dch10_1_N Output_ch2_1_P=ADC_Dch10_1_P Output_ch3_0_N=ADC_Dch11_0_N Output_ch3_0_P=ADC_Dch11_0_P Output_ch3_1_N=ADC_Dch11_1_N Output_ch3_1_P=ADC_Dch11_1_P Output_ch4_0_N=ADC_Dch12_0_N Output_ch4_0_P=ADC_Dch12_0_P Output_ch4_1_N=ADC_Dch12_1_N Output_ch4_1_P=ADC_Dch12_1_P Reset_ADC=Reset_ADC SCLK=SCLK SDATA=SDATA SDOUT=SDOUT SEN=SEN

### Layout directives
differential pair: ADC_1_CLK_N, ADC_1_CLK_P, ADC_Dch1_0_N, ADC_Dch1_0_P, ADC_Dch1_1_N, ADC_Dch1_1_P, ADC_Dch2_0_N, ADC_Dch2_0_P, ADC_Dch2_1_N, ADC_Dch2_1_P, ADC_Dch3_0_N, ADC_Dch3_0_P, ADC_Dch3_1_N, ADC_Dch3_1_P, ADC_Dch4_0_N, ADC_Dch4_0_P, ADC_Dch4_1_N, ADC_Dch4_1_P, ADC_DCLK_1_N, ADC_DCLK_1_P, ADC_FCLK_1_N, ADC_FCLK_1_P

### Notes on the sheet
- default (VCC - off)
- (near R46) ~0.1 V

### Library data of the parts
C1-C21 Cu1-Cu16 = C: Text Field1: 20; Text Field2: 10
R1-R4 = R: Text Field1: 20; Text Field2: 20
R5-R46 = R: Text Field1: 20; Text Field2: 20
U3 = ADC3424
Usup1 = AD8005ART: Text Field1: 40; Text Field2: 40

## Sheet Analog.SchDoc
size A4
Used 12 times, as channels Digit_1/Analog_input, Digit_1/Analog_input, Digit_1/Analog_input, Digit_1/Analog_input, Digit_2/Analog_input, Digit_2/Analog_input, Digit_2/Analog_input, Digit_2/Analog_input, Digit_3/Analog_input, Digit_3/Analog_input, Digit_3/Analog_input, Digit_3/Analog_input. Parts and nets are listed once, with the designators drawn on the sheet.
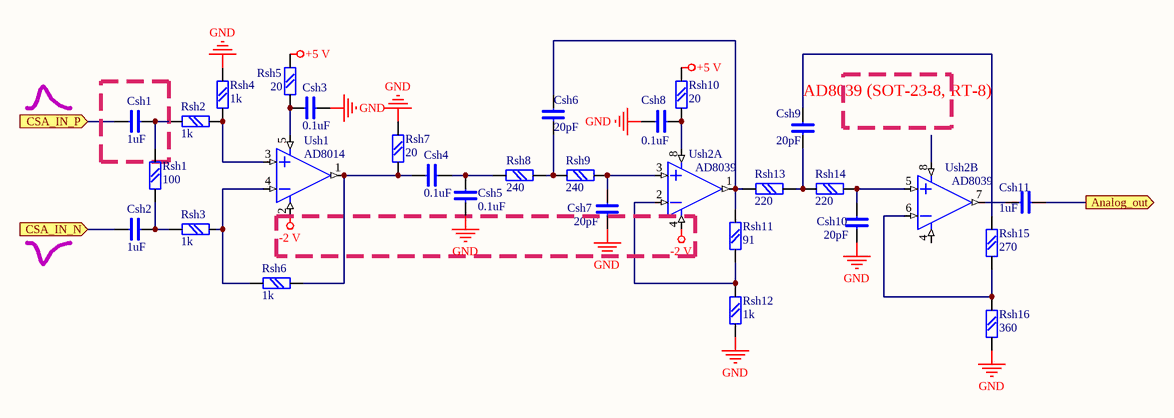
[diagram p2: Analog.SchDoc]

### Parts
Csh1  1uF  [chip0603]
Csh2  1uF  [chip0603]
Csh3  0.1uF  [chip0603]
Csh4  0.1uF  [chip0603]
Csh5  0.1uF  [chip0603]
Csh6  20pF  [chip0603]
Csh7  20pF  [chip0603]
Csh8  0.1uF  [chip0603]
Csh9  20pF  [chip0603]
Csh10  20pF  [chip0603]
Csh11  1uF  [chip0603]
Rsh1  100  [chip0603]
Rsh2  1k  [chip0603]
Rsh3  1k  [chip0603]
Rsh4  1k  [chip0603]
Rsh5  20  [chip0603]
Rsh6  1k  [chip0603]
Rsh7  20  [chip0603]
Rsh8  240  [chip0603]
Rsh9  240  [chip0603]
Rsh10  20  [chip0603]
Rsh11  91  [chip0603]
Rsh12  1k  [chip0603]
Rsh13  220  [chip0603]
Rsh14  220  [chip0603]
Rsh15  270  [chip0603]
Rsh16  360  [chip0603]
Ush1  AD8014  [RT-5]
Ush2  AD8039  [SOT23-8]  (parts A,B of 2)

### Ports
Analog_out (out), CSA_IN_N (in), CSA_IN_P (in)

### Nets
+5 V: Rsh5.2 Rsh10.2
-2 V: Ush1.2(E-) Ush2.4(E-)
GND: Csh3.2 Csh5.2 Csh7.2 Csh8.2 Csh10.2 Rsh4.2 Rsh7.1 Rsh12.1 Rsh16.1
Analog_out: Csh11.2 ; port Analog_out
CSA_IN_N: Csh2.1 ; port CSA_IN_N
CSA_IN_P: Csh1.1 ; port CSA_IN_P
NetCsh1_2: Csh1.2 Rsh1.2 Rsh2.1
NetCsh2_2: Csh2.2 Rsh1.1 Rsh3.1
NetCsh3_1: Csh3.1 Rsh5.1 Ush1.5(E+)
NetCsh4_1: Csh4.1 Csh5.1 Rsh8.2
NetCsh4_2: Csh4.2 Rsh6.2 Rsh7.2 Ush1.1(OUT)
NetCsh6_1: Csh6.1 Rsh11.2 Rsh13.2 Ush2.1(OUT)
NetCsh6_2: Csh6.2 Rsh8.1 Rsh9.1
NetCsh7_1: Csh7.1 Rsh9.2 Ush2.3(+IN)
NetCsh8_1: Csh8.1 Rsh10.1 Ush2.8(E+)
NetCsh9_1: Csh9.1 Rsh15.2
NetCsh9_2: Csh9.2 Rsh13.1 Rsh14.1
NetCsh10_1: Csh10.1 Rsh14.2 Ush2.5(+IN)
NetCsh11_1: Csh11.1 Ush2.7(OUT)
NetRsh2_2: Rsh2.2 Rsh4.1 Ush1.3(+IN)
NetRsh3_2: Rsh3.2 Rsh6.1 Ush1.4(-IN)
NetRsh11_1: Rsh11.1 Rsh12.2 Ush2.2(-IN)
NetRsh15_1: Rsh15.1 Rsh16.2 Ush2.6(-IN)

### Channels
Digit_1/Analog_input: designators end in _Digit_1_Analog_input#1; ports Analog_out=NetCsh11_Digit_1_Analog_input#1_2 CSA_IN_N=CSA_IN-_4 CSA_IN_P=CSA_IN+_4
Digit_1/Analog_input: designators end in _Digit_1_Analog_input#2; ports Analog_out=NetCsh11_Digit_1_Analog_input#2_2 CSA_IN_N=CSA_IN-_3 CSA_IN_P=CSA_IN+_3
Digit_1/Analog_input: designators end in _Digit_1_Analog_input#3; ports Analog_out=NetCsh11_Digit_1_Analog_input#3_2 CSA_IN_N=CSA_IN-_2 CSA_IN_P=CSA_IN+_2
Digit_1/Analog_input: designators end in _Digit_1_Analog_input#4; ports Analog_out=NetCsh11_Digit_1_Analog_input#4_2 CSA_IN_N=CSA_IN-_1 CSA_IN_P=CSA_IN+_1
Digit_2/Analog_input: designators end in _Digit_2_Analog_input#1; ports Analog_out=NetCsh11_Digit_2_Analog_input#1_2 CSA_IN_N=CSA_IN-_8 CSA_IN_P=CSA_IN+_8
Digit_2/Analog_input: designators end in _Digit_2_Analog_input#2; ports Analog_out=NetCsh11_Digit_2_Analog_input#2_2 CSA_IN_N=CSA_IN-_7 CSA_IN_P=CSA_IN+_7
Digit_2/Analog_input: designators end in _Digit_2_Analog_input#3; ports Analog_out=NetCsh11_Digit_2_Analog_input#3_2 CSA_IN_N=CSA_IN-_6 CSA_IN_P=CSA_IN+_6
Digit_2/Analog_input: designators end in _Digit_2_Analog_input#4; ports Analog_out=NetCsh11_Digit_2_Analog_input#4_2 CSA_IN_N=CSA_IN-_5 CSA_IN_P=CSA_IN+_5
Digit_3/Analog_input: designators end in _Digit_3_Analog_input#1; ports Analog_out=NetCsh11_Digit_3_Analog_input#1_2 CSA_IN_N=CSA_IN-_12 CSA_IN_P=CSA_IN+_12
Digit_3/Analog_input: designators end in _Digit_3_Analog_input#2; ports Analog_out=NetCsh11_Digit_3_Analog_input#2_2 CSA_IN_N=CSA_IN-_11 CSA_IN_P=CSA_IN+_11
Digit_3/Analog_input: designators end in _Digit_3_Analog_input#3; ports Analog_out=NetCsh11_Digit_3_Analog_input#3_2 CSA_IN_N=CSA_IN-_10 CSA_IN_P=CSA_IN+_10
Digit_3/Analog_input: designators end in _Digit_3_Analog_input#4; ports Analog_out=NetCsh11_Digit_3_Analog_input#4_2 CSA_IN_N=CSA_IN-_9 CSA_IN_P=CSA_IN+_9

### Notes on the sheet
- (near Csh9) AD8039 (SOT-23-8, RT-8)

### Library data of the parts
Csh1-Csh11 = C: Text Field1: 20; Text Field2: 10
Rsh1-Rsh4 Rsh6 Rsh8 Rsh9 Rsh11-Rsh16 = R: Text Field1: 20; Text Field2: 20
Rsh5 Rsh7 Rsh10 = R: Text Field1: 20; Text Field2: 20
Ush1 = AD8005ART: Text Field1: 40; Text Field2: 40
Ush2 = AD8008

## Sheet Ref&Supply Unit.SchDoc
size A4; DocumentNumber: 5; SheetNumber: 5; SheetTotal: 7
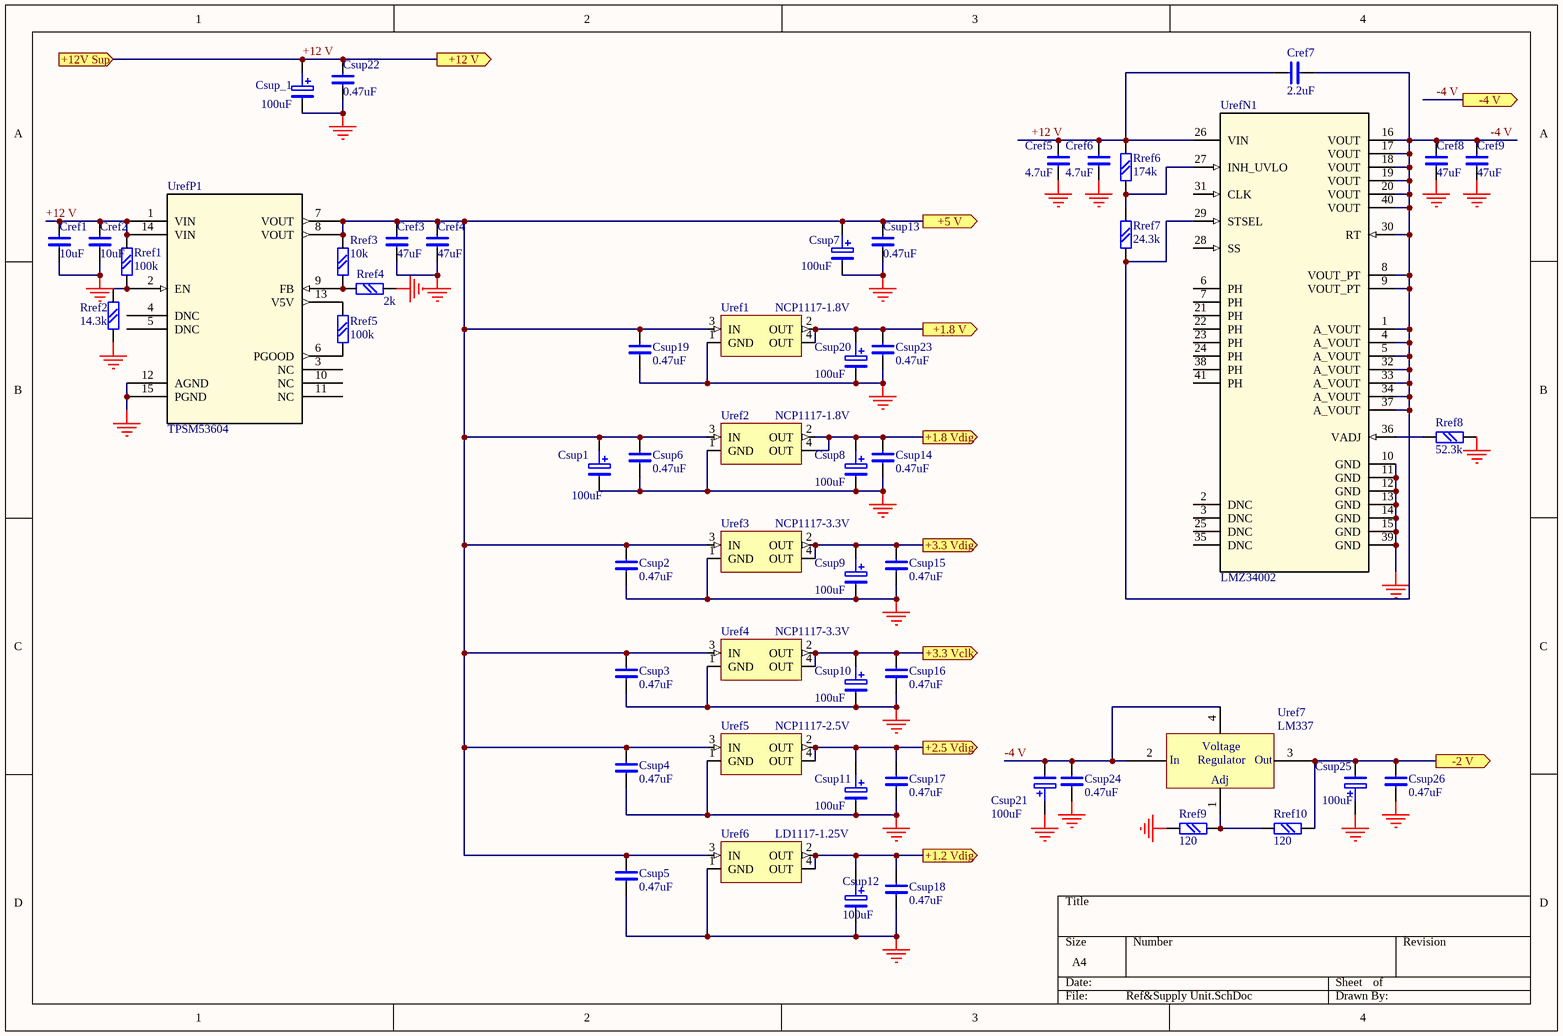
[diagram p3: Ref&Supply Unit.SchDoc]

### Parts
Cref1  10uF  [CHIP1206]
Cref2  10uF  [CHIP1206]
Cref3  47uF  [CHIP1206]
Cref4  47uF  [CHIP1206]
Cref5  4.7uF  [chip0805]
Cref6  4.7uF  [chip0805]
Cref7  2.2uF  [chip0805]
Cref8  47uF  [chip1206]
Cref9  47uF  [chip1206]
Csup1  100uF  [CEL-SMD300]
Csup2  0.47uF  [chip0603]
Csup3  0.47uF  [chip0603]
Csup4  0.47uF  [chip0603]
Csup5  0.47uF  [chip0603]
Csup6  0.47uF  [chip0603]
Csup7  100uF  [CEL-SMD300]
Csup8  100uF  [CEL-SMD300]
Csup9  100uF  [CEL-SMD300]
Csup10  100uF  [CEL-SMD300]
Csup11  100uF  [CEL-SMD300]
Csup12  100uF  [CEL-SMD300]
Csup13  0.47uF  [chip0603]
Csup14  0.47uF  [chip0603]
Csup15  0.47uF  [chip0603]
Csup16  0.47uF  [chip0603]
Csup17  0.47uF  [chip0603]
Csup18  0.47uF  [chip0603]
Csup19  0.47uF  [chip0603]
Csup20  100uF  [CEL-SMD300]
Csup21  100uF  [CEL-SMD300]
Csup22  0.47uF  [chip0603]
Csup23  0.47uF  [chip0603]
Csup24  0.47uF  [chip0603]
Csup25  100uF  [CEL-SMD300]
Csup26  0.47uF  [chip0603]
Csup_1  100uF  [CEL-SMD300]
Rref1  100k  [chip0603]
Rref2  14.3k  [chip0603]
Rref3  10k  [chip0603]
Rref4  2k  [chip0603]
Rref5  100k  [chip0603]
Rref6  174k  [chip0603]
Rref7  24.3k  [chip0603]
Rref8  52.3k  [chip0603]
Rref9  120  [chip0603]
Rref10  120  [chip0603]
Uref1  NCP1117-1.8V  [369A-13]
Uref2  NCP1117-1.8V  [369A-13]
Uref3  NCP1117-3.3V  [369A-13]
Uref4  NCP1117-3.3V  [369A-13]
Uref5  NCP1117-2.5V  [369A-13]
Uref6  LD1117-1.25V  [369A-13]
Uref7  LM337  [SOT-223]
UrefN1  LMZ34002  [B1QFN-41]
UrefP1  TPSM53604  [B3QFN-15]

### Ports
+1.2 Vdig (out), +1.8 V (out), +1.8 Vdig (out), +2.5 Vdig (out), +3.3 Vclk (out), +3.3 Vdig (out), +5 V (out), +12 V (out), +12V Sup (in), -2 V (out), -4 V (out)

### Nets
+1.2 Vdig: Csup12.+ Csup18.1 Uref6.2(OUT) Uref6.4(OUT) ; port +1.2 Vdig
+1.8 V: Csup20.+ Csup23.1 Uref1.2(OUT) Uref1.4(OUT) ; port +1.8 V
+1.8 Vdig: Csup8.+ Csup14.1 Uref2.2(OUT) Uref2.4(OUT) ; port +1.8 Vdig
+2.5 Vdig: Csup11.+ Csup17.1 Uref5.2(OUT) Uref5.4(OUT) ; port +2.5 Vdig
+3.3 Vclk: Csup10.+ Csup16.1 Uref4.2(OUT) Uref4.4(OUT) ; port +3.3 Vclk
+3.3 Vdig: Csup9.+ Csup15.1 Uref3.2(OUT) Uref3.4(OUT) ; port +3.3 Vdig
+5 V: Cref3.1 Cref4.1 Csup1.+ Csup2.1 Csup3.1 Csup4.1 Csup5.1 Csup6.1 Csup7.+ Csup13.1 Csup19.1 Rref3.2 Uref1.3(IN) Uref2.3(IN) Uref3.3(IN) Uref4.3(IN) Uref5.3(IN) Uref6.3(IN) UrefP1.7(VOUT) UrefP1.8(VOUT) ; port +5 V
+12 V: Cref1.1 Cref2.1 Cref5.1 Cref6.1 Cref7.1 Csup22.1 Csup_1.+ Rref1.2 Rref6.2 UrefN1.26(VIN) UrefP1.1(VIN) UrefP1.14(VIN) ; port +12V Sup, port +12 V
-2 V: Csup25.- Csup26.1 Rref10.1 Uref7.3(Out) ; port -2 V
-4 V: Cref7.2 Cref8.1 Cref9.1 Csup21.- Csup24.1 Rref7.1 Uref7.2(In) Uref7.4(Substrate) UrefN1.1(A_VOUT) UrefN1.4(A_VOUT) UrefN1.5(A_VOUT) UrefN1.8(VOUT_PT) UrefN1.9(VOUT_PT) UrefN1.16(VOUT) UrefN1.17(VOUT) UrefN1.18(VOUT) UrefN1.19(VOUT) UrefN1.20(VOUT) UrefN1.29(STSEL) UrefN1.30(RT) UrefN1.32(A_VOUT) UrefN1.33(A_VOUT) UrefN1.34(A_VOUT) UrefN1.37(A_VOUT) UrefN1.40(VOUT) ; port -4 V
GND: Cref1.2 Cref2.2 Cref3.2 Cref4.2 Cref5.2 Cref6.2 Cref8.2 Cref9.2 Csup1.- Csup2.2 Csup3.2 Csup4.2 Csup5.2 Csup6.2 Csup7.- Csup8.- Csup9.- Csup10.- Csup11.- Csup12.- Csup13.2 Csup14.2 Csup15.2 Csup16.2 Csup17.2 Csup18.2 Csup19.2 Csup20.- Csup21.+ Csup22.2 Csup23.2 Csup24.2 Csup25.+ Csup26.2 Csup_1.- Rref2.1 Rref4.1 Rref8.2 Rref9.2 Uref1.1(GND) Uref2.1(GND) Uref3.1(GND) Uref4.1(GND) Uref5.1(GND) Uref6.1(GND) UrefN1.10(GND) UrefN1.11(GND) UrefN1.12(GND) UrefN1.13(GND) UrefN1.14(GND) UrefN1.15(GND) UrefN1.39(GND) UrefP1.12(AGND) UrefP1.15(PGND)
NetRref1_1: Rref1.1 Rref2.2 UrefP1.2(EN)
NetRref3_1: Rref3.1 Rref4.2 UrefP1.9(FB)
NetRref5_1: Rref5.1 UrefP1.6(PGOOD)
NetRref5_2: Rref5.2 UrefP1.13(V5V)
NetRref6_1: Rref6.1 Rref7.2 UrefN1.27(INH_UVLO)
NetRref8_1: Rref8.1 UrefN1.36(VADJ)
NetRref9_1: Rref9.1 Rref10.2 Uref7.1(ADJ)

Not connected (* = marked no-connect by the designer): UrefN1 2(DNC) 3(DNC) 6(PH) 7(PH) 21(PH) 22(PH) 23(PH) 24(PH) 25(DNC) 28(SS) 31(CLK) 35(DNC) 38(PH) 41(PH); UrefP1 3(NC) 4(DNC) 5(DNC) 10(NC) 11(NC)

### Notes on the sheet
- (in symbol LM337) Voltage; Regulator; Adj

### Library data of the parts
Cref1-Cref9 Csup2-Csup6 Csup13-Csup19 Csup22-Csup24 Csup26 = C: Text Field1: 20; Text Field2: 10
Csup1 Csup7-Csup12 Csup20 Csup21 Csup25 Csup_1 = C POL: Text Field1: 20; Text Field2: 20
Rref1-Rref10 = MLT: Text Field1: 20; Text Field2: 20
Uref1 Uref2 Uref5 Uref6 = NCP1117-3.3V
Uref7 = LM337: Adjustable Negative Volage Regulators